# EAGLE design SerialBTBridge (EAGLE 7.4.0)
CNAME: Serial to Bluetooth Bridge; CREVISION: 1.0; DESIGNER: Ye Wang
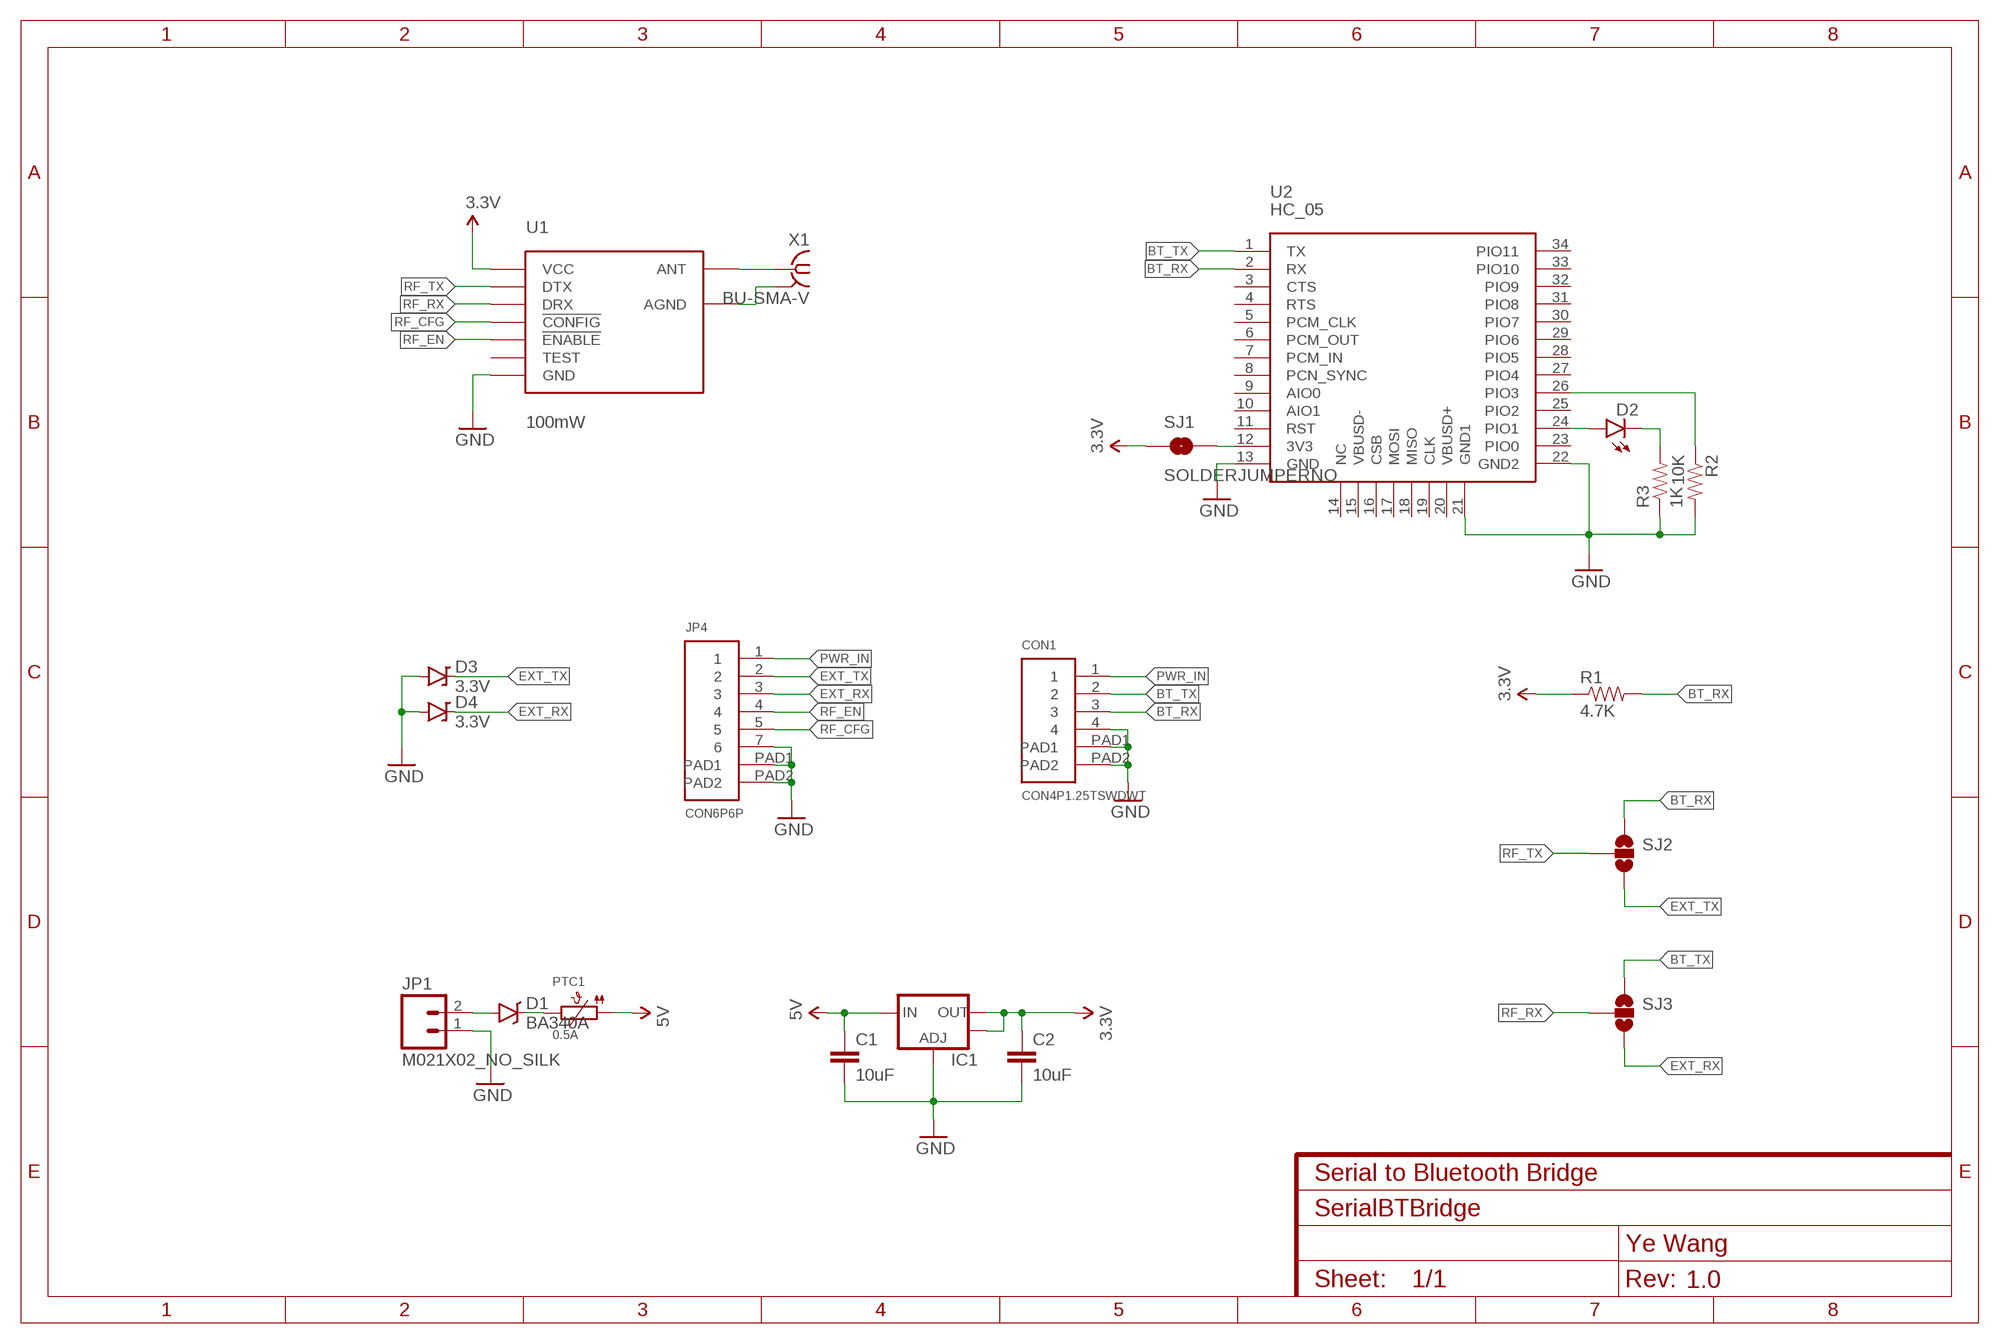
[diagram p0: schematic, sheet 1]

## Parts
C1  10uF  CAP0805W  [0805-CAP]
C2  10uF  10UF-6.3V-20%(0603)  [0603-CAP]
CON1  CON4P1.25TSWDWT  [1.25T4P]
D1  BA340A  B340A  [SMA-DIODE]
D2  LED0603  [LED-0603]
D3  3.3V  DIODE-ZENER3.3V  [SOD-323]
D4  3.3V  DIODE-ZENER3.3V  [SOD-323]
IC1  V_REG_LM1117SOT223  [SOT223]
JP1  M021X02_NO_SILK  [1X02_NO_SILK]
JP4  CON6P6P  [1.25T6P]
PTC1  0.5A  PTC1812  [PTC1812]
R1  4.7K  4.7KOHM-1/10W-1%(0603)  [0603-RES]
R2  10K  10KOHM-1/10W-1%(0603)0603  [0603-RES]
R3  1K  1KOHM-1/10W-1%(0603)  [0603-RES]
SJ1  SOLDERJUMPERNO  [SJ_2S-NO]
SJ2  SOLDERJUMPER_2WAYS  [SJ_3]
SJ3  SOLDERJUMPER_2WAYS  [SJ_3]
U1  100mW  HM-TRPSMD  [HM-TRP-SMD]
U2  HC_05  [BLUETOOTH_SMD]
X1  BU-SMA-V  [BU-SMA-V]

## Nets
3.3V: C2.1 IC1.2(OUT) IC1.4(OUT) R1.1 SJ1.1 U1.VCC
5V: C1.P$1 IC1.3(IN) PTC1.P$1
ANT_GND: U1.AGND X1.2 X1.3 X1.4 X1.5
BT_RX: CON1.3 R1.2 SJ2.1 U2.2(RX)
BT_TX: CON1.2 SJ3.1 U2.1(TX)
EXT_RX: D4.C JP4.3 SJ3.3
EXT_TX: D3.C JP4.2 SJ2.3
GND: C1.P$2 C2.2 CON1.4 CON1.PAD1 CON1.PAD2 D3.A D4.A IC1.1(ADJ) JP1.1 JP4.7 JP4.PAD1 JP4.PAD2 R2.2 R3.1 U1.GND U2.13(GND) U2.21(GND1) U2.22(GND2)
N$1: U1.ANT X1.1
N$3: SJ1.2 U2.12(3V3)
N$4: R2.1 U2.26(PIO3)
N$5: D1.C PTC1.P$2
N$6: D2.A U2.24(PIO1)
N$7: D2.C R3.2
PWR_IN: CON1.1 D1.A JP1.2 JP4.1
RF_CFG: JP4.5 U1.!CONFIG
RF_EN: JP4.4 U1.!ENABLE
RF_RX: SJ3.2 U1.DRX
RF_TX: SJ2.2 U1.DTX
Unconnected: U1.TEST U2.3(CTS) U2.4(RTS) U2.5(PCM_CLK) U2.6(PCM_OUT) U2.7(PCM_IN) U2.8(PCN_SYNC) U2.9(AIO0) U2.10(AIO1) U2.11(RST) U2.14(NC) U2.15(VBUSD-) U2.16(CSB) U2.17(MOSI) U2.18(MISO) U2.19(CLK) U2.20(VBUSD+) U2.23(PIO0) U2.25(PIO2) U2.27(PIO4) U2.28(PIO5) U2.29(PIO6) U2.30(PIO7) U2.31(PIO8) U2.32(PIO9) U2.33(PIO10) U2.34(PIO11)

## Library data of the parts
C1 = SparkFun-Capacitors:CAP: Capacitor Standard 0603 ceramic capacitor, and 0.1" leaded capacitor.
C2 = SparkFun-Capacitors:10UF-6.3V-20%(0603): CAP-11015; PROD_ID: CAP-11015
CON1 = szjlc:CON4P
D1 = SparkFun-DiscreteSemi:B340A: Schottky Diode 3A-40V; PROD_ID: DIO-09886
D2 = SparkFun-LED:LED: LEDs Standard schematic elements and footprints for 5mm, 3mm, 1206, and 0603 sized LEDs. 5mm - Spark Fun Electronics SKU : COM-00529 (and others)
D3 D4 = SparkFun-DiscreteSemi:DIODE-ZENER: Zener Diode Production Part - 8199 3.4V Zener Voltage; PROD_ID: DIO-11284
IC1 = SparkFun-PowerIC:V_REG_LM1117: Voltage Regulator LM1117 Standard adjustable voltage regulator but in SMD form. Spark Fun Electronics SKU : COM-00595; PROD_ID: VREG-08170
JP1 = SparkFun-Connectors:M02: Standard 2-pin 0.1" header. Use with - straight break away headers ( PRT-00116) - right angle break away headers (PRT-00553) - swiss pins (PRT-00743) - machine pins (PRT-00117) - female headers (PRT-00115) Molex polarized connector foot print use with: PRT-08233 with associated crimp pins and housings. 2.54_SCREWTERM for use with PRT-10571. 3.5mm Screw Terminal footprints for PRT-08084 5mm Screw Terminal footprints for use with PRT-08432
JP4 = szjlc:CON6P
PTC1 = microbuilder:PTC: PTC (Resettable Fuse) 1206 Package 250mA PTC (16V Max, Time-to-Trip: 0.08s) - Digikey: F2110CT-ND 1210 Package 100mA PTC (30V Max, Time-to-Trip: 0.6s) - Digikey: MF-USMF010-2CT-ND 1812 Package 750mA PTC (24V Max, Time-to-Trip: 0.2s) - Digikey: MF-MSMF075/24-2CT-ND
R1 = SparkFun-Resistors:4.7KOHM-1/10W-1%(0603): RES-07857; PROD_ID: RES-07857
R2 = SparkFun-Resistors:10KOHM-1/10W-1%(0603): RES-00824; PROD_ID: RES-00824
R3 = SparkFun-Resistors:1KOHM-1/10W-1%(0603): RES-07856; PROD_ID: RES-07856
SJ1 = SparkFun-Retired:SOLDERJUMPER: Solder Jumper Standard SMD solder jumper. Used to automate production. Two varients : Normally Open and Normally Closed are the same, but have different paste layers. NC will have a large amount of paste and should jumper during reflow.
SJ2 SJ3 = SparkFun-Retired:SOLDERJUMPER_2WAY: Solder Jumper 2 way solder jumper
U1 = HM-TRP:HM-TRP: HM-TRP Series 100mW Transceiver module HM-TRP series is a low cost, high performance transparent FSK transceiver with operating at 433/470/868/915 MHz. It features small size, high output power, high sensitivity, long transmission distance and high communication data rate with auto set up for communication change and data receiving and transmission control. There is UART interface, it is easy to realize the wireless data transmission with only providing the UART data. It is flexible for the users to set the UART baud rate, frequency, output power, data rate, frequency deviation, receiving bandwidth etc parameters. It is your ideal choice for designing wireless data transmission products which can be widely used on wireless data transmission field.
U2 = SerialPortBluetooth:HC_05
X1 = con-coax:BU-SMA-V: FEMALE SMA CONNECTOR Radiall distributor RS 112-3794; OC_FARNELL: unknown; OC_NEWARK: unknown

## Board
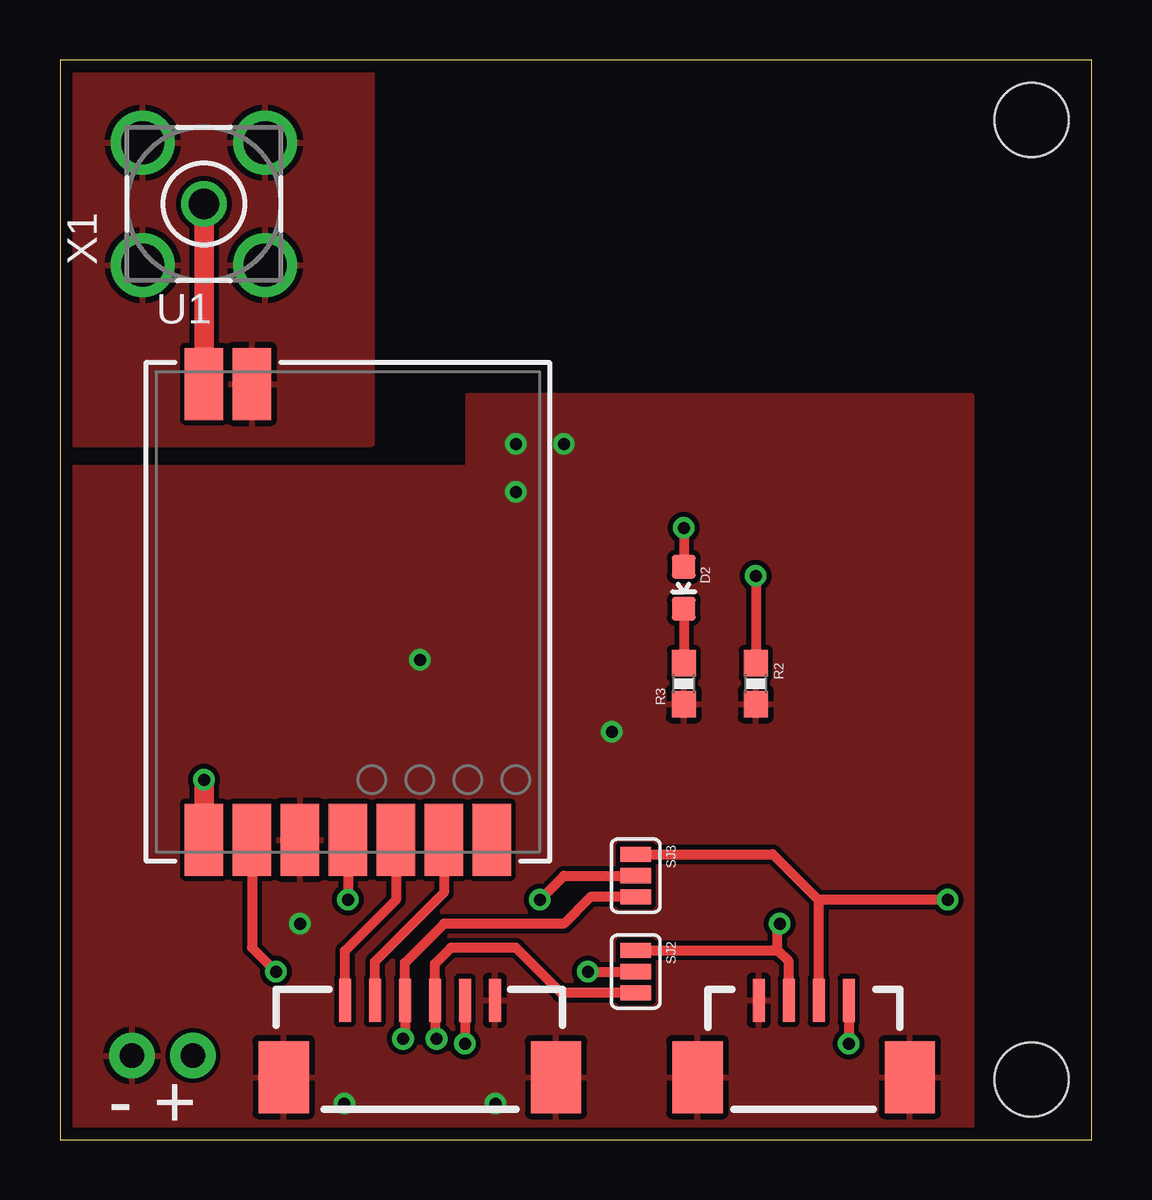
[diagram p1: board, top side]
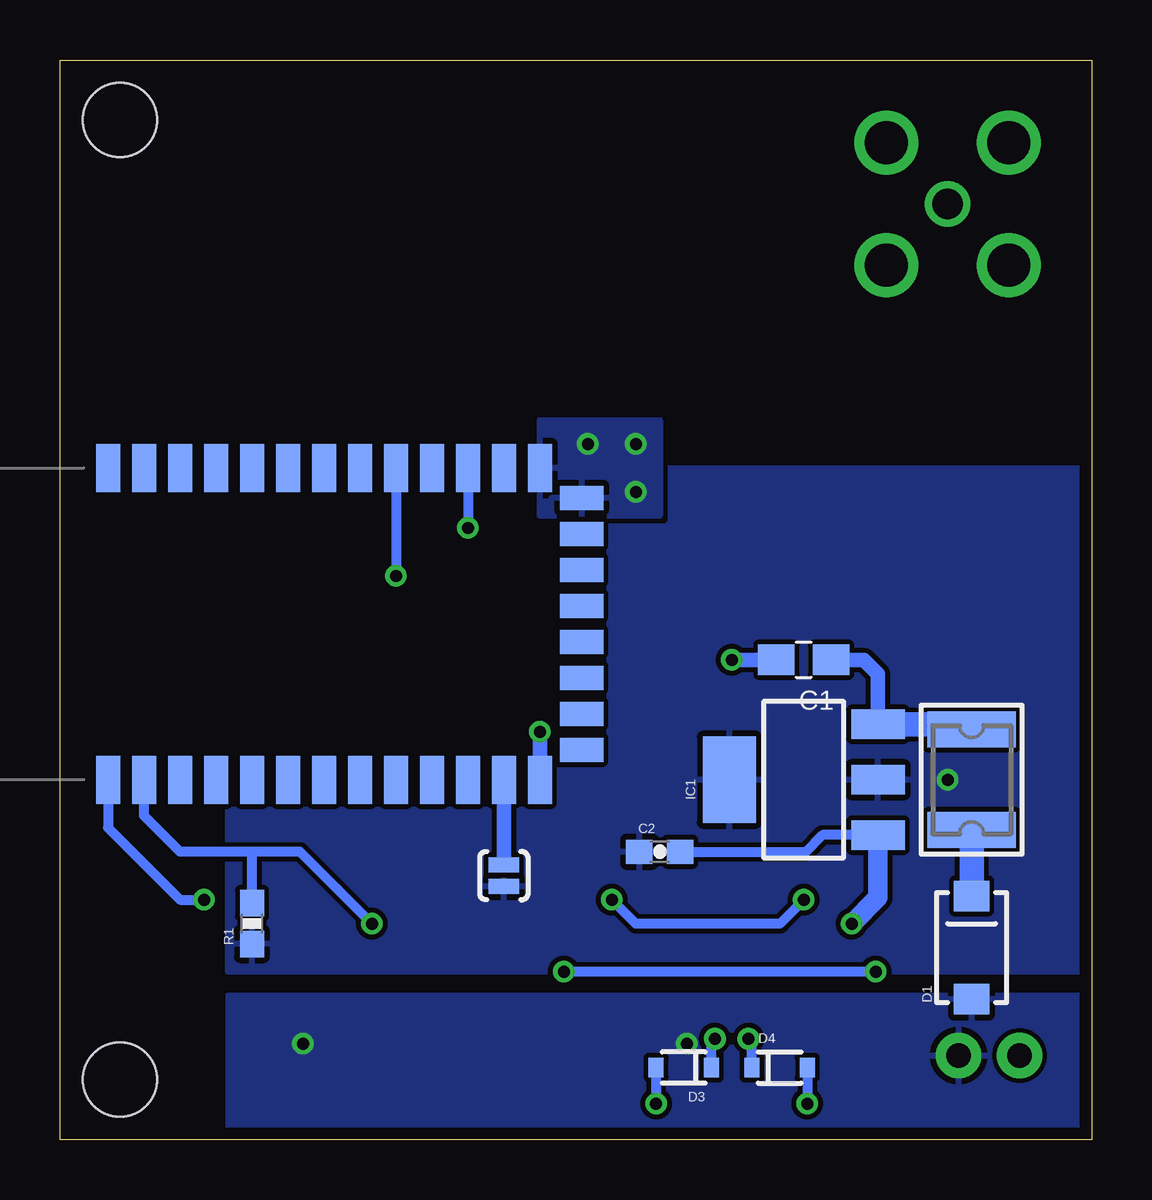
[diagram p2: board, bottom side, seen from below]

Size 43 x 45 mm. Coordinates in mm from the lower left corner, seen from the top.
Outline: 0,0 43,0 43,45 0,45 0,0
Copper layers (1*16): Top 0.035mm / dielectric 1.5mm / Bottom 0.035mm
Design rules "default *": minimum track width 10mil, minimum drill 0.3mm, track to track 8mil, track to pad 8mil, pad to pad 8mil, via to via 8mil, smd to smd 8mil, copper to edge 20mil, drill to drill 6mil, minimum pad ring 10mil, minimum via ring 8mil, stop-mask expansion 4mil, vias tented up to drill 0.55mm, thermal gap 10mil
Holes 3.1 mm at 40.5,42.5 40.5,2.5

### Footprints (pad centres in the part's own frame; a part is rotated, then mirrored left to right if it is on the bottom)
0805-CAP = smd 1.524 x 1.27: P$1 -1.143,0; P$2 1.143,0
0603-CAP = smd 1.1 x 1: 1 -0.85,0; 2 0.85,0
1.25T4P = smd 0.5 x 1.8: 1 -1.875,-1.8; 2 -0.625,-1.8; 3 0.625,-1.8; 4 1.875,-1.8 | smd 2.1 x 3: PAD1 -4.425,1.4; PAD2 4.425,1.4
SMA-DIODE = smd 1.27 x 1.47: A -2.15,0; C 2.15,0
LED-0603 = smd 1 x 1: A 0,-0.877; C 0,0.877
SOD-323 = smd 0.63 x 0.83: A 1.15,0; C -1.15,0
SOT223 = smd 1.219 x 2.235: 1 -2.311,-3.099; 2 0,-3.099; 3 2.311,-3.099 | smd 3.6 x 2.2: 4 0,3.099
1X02_NO_SILK = drill 1.016 pad 1.88: 1 0,0; 2 2.54,0
1.25T6P = smd 0.5 x 1.8: 1 -1.875,-1.8; 2 -0.625,-1.8; 3 0.625,-1.8; 4 1.875,-1.8; 5 3.125,-1.8; 7 -3.125,-1.8 | smd 2.1 x 3: PAD1 -5.675,1.4; PAD2 5.675,1.4
PTC1812 = smd 1.5 x 3.7: P$1 -2.1,0; P$2 2.1,0
0603-RES = smd 1.1 x 1: 1 -0.85,0; 2 0.85,0
SJ_2S-NO = smd 0.635 x 1.27: 1 -0.45,0; 2 0.45,0
SJ_3 = smd 0.635 x 1.27: 1 -0.889,0; 2 0,0; 3 0.889,0
HM-TRP-SMD = smd 1.6 x 3: !CONFIG 2,-9.5; !ENABLE 4,-9.5; AGND -4,9.5; ANT -6,9.5; DRX 0,-9.5; DTX -4,-9.5; GND -2,-9.5; TEST 6,-9.5; VCC -6,-9.5
BLUETOOTH_SMD = smd 2 x 1: 1 0,0; 2 0,-1.5; 3 0,-3; 4 0,-4.5; 5 0,-6; 6 0,-7.5; 7 0,-9; 8 0,-10.5; 9 0,-12; 10 0,-13.5; 11 0,-15; 12 0,-16.5; 13 0,-18; 22 13,-18; 23 13,-16.5; 24 13,-15; 25 13,-13.5; 26 13,-12; 27 13,-10.5; 28 13,-9; 29 13,-7.5; 30 13,-6; 31 13,-4.5; 32 13,-3; 33 13,-1.5; 34 13,0 | smd 1 x 1.8: 14 1.25,-19.75; 15 2.75,-19.75; 16 4.25,-19.75; 17 5.75,-19.75; 18 7.25,-19.75; 19 8.75,-19.75; 20 10.25,-19.75; 21 11.75,-19.75
BU-SMA-V = drill 1.27: 1 0,0 | drill 1.778: 2 -2.55,2.55; 3 2.55,2.55; 4 2.55,-2.55; 5 -2.55,-2.55

### Placement (x,y rotation side)
C1  12,20 180 bottom
C2  18,12 0 bottom
CON1  31,4 180 top
D1  5,8 90 bottom
D2  26,23 180 top
D3  17,3 180 bottom
D4  13,3 0 bottom
IC1  12,15 90 bottom
JP1  3,3.5 0 top
JP4  15,4 180 top
PTC1  5,15 270 bottom
R1  35,9 90 bottom
R2  29,19 270 top
R3  26,19 90 top
SJ1  24.5,11 90 bottom
SJ2  24,7 270 top
SJ3  24,11 270 top
U1  12,22 0 top
U2  41,15 90 bottom
X1  6,39 90 top

### Tracks (layer width: path | path; a pad name or v marks a point on that pad's centre or on a via)
3.3V  (via drill 0.5)
  Top 0.813: U1.VCC v6,15
  pour Bottom (rank 2): 0,7 36,7 36,28 0,28
5V
  Bottom 0.61: IC1.3 8.9,19.4 9.5,20 C1.P$1
  Bottom 1.016: IC1.3 5.21,17.31 PTC1.P$1
ANT_GND
  pour Top: 0,29 13,29 13,45 0,45
BT_RX  (via drill 0.5)
  Top 0.406: SJ2.1 29.91,7.89 | 29.91,7.89 30.38,7.42 CON1.3 | 29.91,7.89 29.91,8.91 v30,9
  Bottom 0.406: v30,9 33,12 35,12 | 35,12 38,12 39.5,13.5 U2.2 | R1.2 35,12
BT_TX  (via drill 0.5)
  Top 0.406: SJ3.1 29.71,11.89 31.62,9.97 | CON1.2 31.62,9.97 | v37,10 31.65,10 31.62,9.97
  Bottom 0.406: U2.1 41,13 38,10 v37,10
EXT_RX  (via drill 0.5)
  Top 0.406: SJ3.3 22.11,10.11 21,9 16,9 14.38,7.38 JP4.3 14.38,4.28 v14.3,4.2
  Bottom 0.406: D4.C 14.15,4.05 v14.3,4.2
EXT_TX  (via drill 0.5)
  Top 0.406: SJ2.3 20.89,6.11 19,8 16.3,8 15.62,7.33 JP4.2 15.62,4.28 v15.7,4.2
  Bottom 0.406: D3.C 15.85,4.05 v15.7,4.2
GND  (via drill 0.5)
  Bottom 0.406: C2.2 11.9,12 11.21,12.69 IC1.1 | D3.A v18.15,1.5 | D4.A v11.85,1.5
  Bottom 0.61: C1.P$2 v15,20 | U2.13 v23,17
  Bottom 0.813: IC1.1 8.9,10.1 v10,9
  other vias: 19,27 19,29 21,29
  pour Top: 0,0 38,0 38,31 17,31 17,28 0,28
  pour Bottom: 18,26 23,26 23,30 18,30
N$1
  Top 0.813: U1.ANT X1.1
N$3
  Bottom 0.61: U2.12 SJ1.2
N$4  (via drill 0.5)
  Top 0.406: v29,23.5 R2.1
  Bottom 0.406: U2.26 v29,23.5
N$5
  Bottom 1.016: D1.C PTC1.P$2
N$6  (via drill 0.5)
  Top 0.406: v26,25.5 D2.A
  Bottom 0.406: U2.24 v26,25.5
N$7
  Top 0.406: D2.C R3.2
PWR_IN  (via drill 0.5)
  Top 0.406: JP4.1 v16.88,4 | CON1.1 v32.88,4
  pour Bottom: 0,6 36,6 36,0 0,0
RF_CFG
  Top 0.406: U1.!CONFIG 14,10 11.88,7.88 JP4.5
RF_EN
  Top 0.406: U1.!ENABLE 16,10.3 13.12,7.42 JP4.4
RF_RX  (via drill 0.5)
  Top 0.406: U1.DRX v12,10 | v20,10 21,11 SJ3.2
  Bottom 0.406: v12,10 13,9 19,9 v20,10
RF_TX  (via drill 0.5)
  Top 0.406: U1.DTX 8,8 v9,7 | v22,7 SJ2.2
  Bottom 0.406: v9,7 v22,7

### Text on the board
tPlace: - +